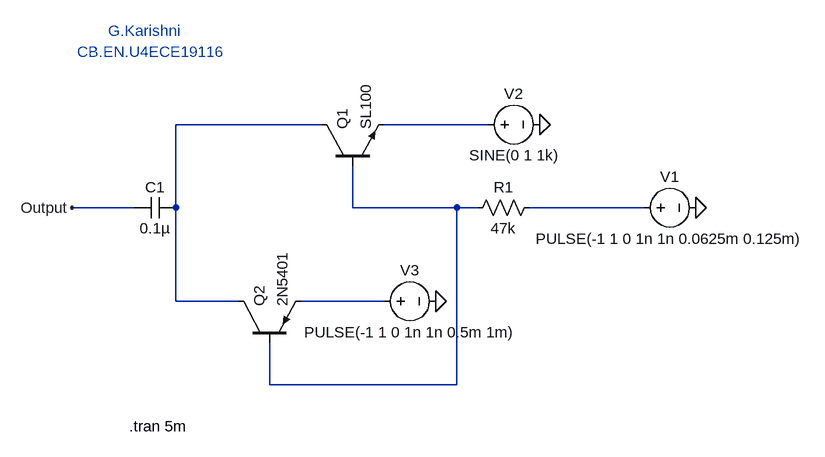
[diagram p0: schematic Draft2.asc]
Draft2.asc, the LTspice schematic file:
Version 4
SHEET 1 936 1268
WIRE 176 128 -48 128
WIRE 432 128 272 128
WIRE -112 256 -208 256
WIRE -48 256 -48 128
WIRE 224 256 224 192
WIRE 384 256 224 256
WIRE 416 256 384 256
WIRE 672 256 496 256
WIRE -48 400 -48 256
WIRE 48 400 -48 400
WIRE 272 400 144 400
WIRE 96 528 96 464
WIRE 384 528 384 256
WIRE 384 528 96 528
FLAG 512 128 0
FLAG -208 256 Output
FLAG 752 256 0
FLAG 352 400 0
SYMBOL npn 176 192 R270
SYMATTR InstName Q1
SYMATTR Value SL100
SYMBOL cap -48 240 R90
WINDOW 0 0 32 VBottom 2
WINDOW 3 32 32 VTop 2
SYMATTR InstName C1
SYMATTR Value 0.1µ
SYMBOL voltage 416 128 R270
WINDOW 0 32 56 VTop 2
WINDOW 3 -32 56 VBottom 2
WINDOW 123 0 0 Left 0
WINDOW 39 0 0 Left 0
SYMATTR InstName V2
SYMATTR Value SINE(0 1 1k)
SYMBOL voltage 656 256 R270
WINDOW 0 32 56 VTop 2
WINDOW 3 -32 56 VBottom 2
WINDOW 123 0 0 Left 0
WINDOW 39 0 0 Left 0
SYMATTR InstName V1
SYMATTR Value PULSE(-1 1 0 1n 1n 0.0625m 0.125m)
SYMBOL res 512 240 R90
WINDOW 0 0 56 VBottom 2
WINDOW 3 32 56 VTop 2
SYMATTR InstName R1
SYMATTR Value 47k
SYMBOL pnp 48 464 R270
SYMATTR InstName Q2
SYMATTR Value 2N5401
SYMBOL voltage 256 400 R270
WINDOW 0 32 56 VTop 2
WINDOW 3 -32 56 VBottom 2
WINDOW 123 0 0 Left 0
WINDOW 39 0 0 Left 0
SYMATTR InstName V3
SYMATTR Value PULSE(-1 1 0 1n 1n 0.5m 1m)
TEXT -120 592 Left 2 !.tran 5m
TEXT -152 -16 Left 2 ;G.Karishni
TEXT -200 16 Left 2 ;CB.EN.U4ECE19116

The netlist it stands for:
* Draft2.asc
Q1 N001 N003 N002 0 SL100
C1 N001 Output 0.1µ
V2 N002 0 SINE(0 1 1k)
V1 N004 0 PULSE(-1 1 0 1n 1n 0.0625m 0.125m)
R1 N004 N003 47k
Q2 N001 N003 N005 0 2N5401
V3 N005 0 PULSE(-1 1 0 1n 1n 0.5m 1m)
.model NPN NPN
.model PNP PNP
.lib standard.bjt
.tran 5m
* G.Karishni
* CB.EN.U4ECE19116
.backanno
.end